# Altium schematic sheet LPDDR4.SchDoc
size A3; SheetNumber: 3; SheetTotal: 3
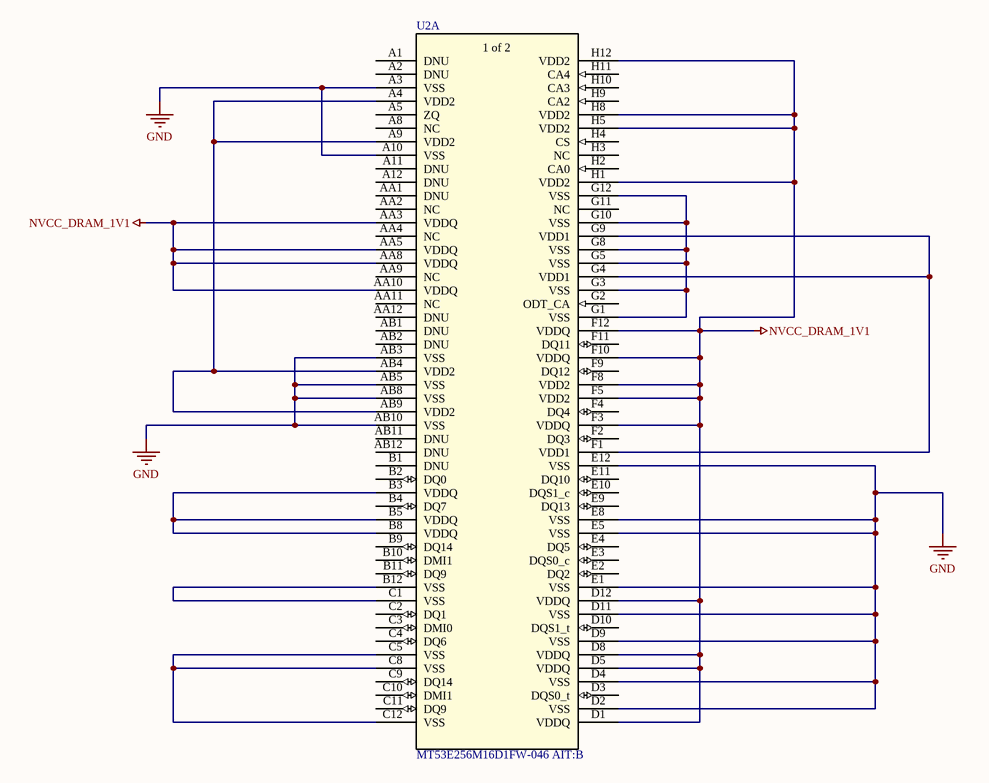
[diagram p0: LPDDR4.SchDoc]

## Parts
U2  MT53E256M16D1FW-046 AIT:B  [TFBGA200_10X14p5X1p1_FW_MRN-M]  (part A of 2)

## Nets
GND: U2.A3(VSS) U2.A10(VSS) U2.AB3(VSS) U2.AB5(VSS) U2.AB8(VSS) U2.AB10(VSS) U2.D2(VSS) U2.D4(VSS) U2.D9(VSS) U2.D11(VSS) U2.E1(VSS) U2.E5(VSS) U2.E8(VSS) U2.E12(VSS)
NVCC_DRAM_1V1: U2.AA3(VDDQ) U2.AA5(VDDQ) U2.AA8(VDDQ) U2.AA10(VDDQ) U2.D1(VDDQ) U2.D5(VDDQ) U2.D8(VDDQ) U2.D12(VDDQ) U2.F3(VDDQ) U2.F5(VDD2) U2.F8(VDD2) U2.F10(VDDQ) U2.F12(VDDQ) U2.H1(VDD2) U2.H5(VDD2) U2.H8(VDD2) U2.H12(VDD2)
NetU2_A4: U2.A4(VDD2) U2.A9(VDD2) U2.AB4(VDD2) U2.AB9(VDD2)
NetU2_B3: U2.B3(VDDQ) U2.B5(VDDQ) U2.B8(VDDQ)
NetU2_B12: U2.B12(VSS) U2.C1(VSS)
NetU2_C5: U2.C5(VSS) U2.C8(VSS) U2.C12(VSS)
NetU2_F1: U2.F1(VDD1) U2.G4(VDD1) U2.G9(VDD1)
NetU2_G1: U2.G1(VSS) U2.G3(VSS) U2.G5(VSS) U2.G8(VSS) U2.G10(VSS) U2.G12(VSS)

Not connected (* = marked no-connect by the designer): U2 A1(DNU) A2(DNU) A5(ZQ) A8(NC) A11(DNU) A12(DNU) AA1(DNU) AA2(NC) AA4(NC) AA9(NC) AA11(NC) AA12(DNU) AB1(DNU) AB2(DNU) AB11(DNU) AB12(DNU) B1(DNU) B2(DQ0) B4(DQ7) B9(DQ14) B10(DMI1) B11(DQ9) C2(DQ1) C3(DMI0) C4(DQ6) C9(DQ14) C10(DMI1) C11(DQ9) D3(DQS0_t) D10(DQS1_t) E2(DQ2) E3(DQS0_c) E4(DQ5) E9(DQ13) E10(DQS1_c) E11(DQ10) F2(DQ3) F4(DQ4) F9(DQ12) F11(DQ11) G2(ODT_CA) G11(NC) H2(CA0) H3(NC) H4(CS) H9(CA2) H10(CA3) H11(CA4)

## Notes on the sheet
- (in symbol MT53E256M16D1FW-046 AIT:B, part A) 1 of 2

## Library data of the parts
U2 = MT53E256M16D1FW-046 AIT:B: No Description Available; Mfr_Name: Micron; Type: Memory; RefDes: RefDes